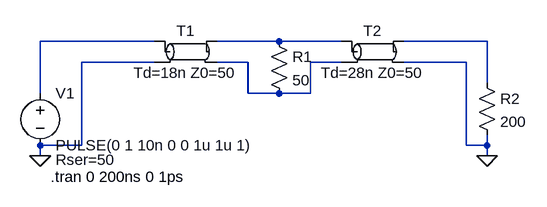
[diagram p0: schematic p2.asc]
p2.asc, the LTspice schematic file:
Version 4
SHEET 1 880 680
WIRE 208 224 32 224
WIRE 400 224 304 224
WIRE 496 224 400 224
WIRE 720 224 592 224
WIRE 208 256 96 256
WIRE 352 256 304 256
WIRE 496 256 448 256
WIRE 688 256 592 256
WIRE 720 288 720 224
WIRE 32 304 32 224
WIRE 352 304 352 256
WIRE 400 304 352 304
WIRE 448 304 448 256
WIRE 448 304 400 304
WIRE 96 384 96 256
WIRE 96 384 32 384
WIRE 688 384 688 256
WIRE 720 384 720 368
WIRE 720 384 688 384
WIRE 32 400 32 384
WIRE 720 400 720 384
FLAG 32 400 0
FLAG 720 400 0
SYMBOL tline 256 240 R0
SYMATTR InstName T1
SYMATTR Value Td=18n Z0=50
SYMBOL tline 544 240 R0
SYMATTR InstName T2
SYMATTR Value Td=28n Z0=50
SYMBOL Voltage 32 288 R0
WINDOW 39 24 118 Left 2
SYMATTR SpiceLine Rser=50
SYMATTR InstName V1
SYMATTR Value PULSE(0 1 10n 0 0 1u 1u 1)
SYMBOL Res 384 208 R0
SYMATTR InstName R1
SYMATTR Value 50
SYMBOL Res 704 272 R0
SYMATTR InstName R2
SYMATTR Value 200
TEXT 48 432 Left 2 !.tran 0 200ns 0 1ps

The netlist it stands for:
* p2.asc
T1 N001 0 N002 N004 Td=18n Z0=50
T2 N002 N004 N003 0 Td=28n Z0=50
V1 N001 0 PULSE(0 1 10n 0 0 1u 1u 1) Rser=50
R1 N002 N004 50
R2 N003 0 200
.tran 0 200ns 0 1ps
.backanno
.end